# Altium schematic sheet 接线图-流量计.SchDoc
size A3; PageSetup: Record=PageOptions|CenterHorizontal=True|CenterVertical=True|PrintScale=1.04|XCorrection=1.00|YCorrection=1.00|PrintKind=0|BorderSize=5000000|LeftOffset=0|BottomOffset=0|Orientation=2|PaperLength=1000|PaperWidth=1000|Scale=100|PaperSource=7|PrintQuality=600|MediaType=1|DitherType=10|PaperKind=A3|PrintScaleMode=1
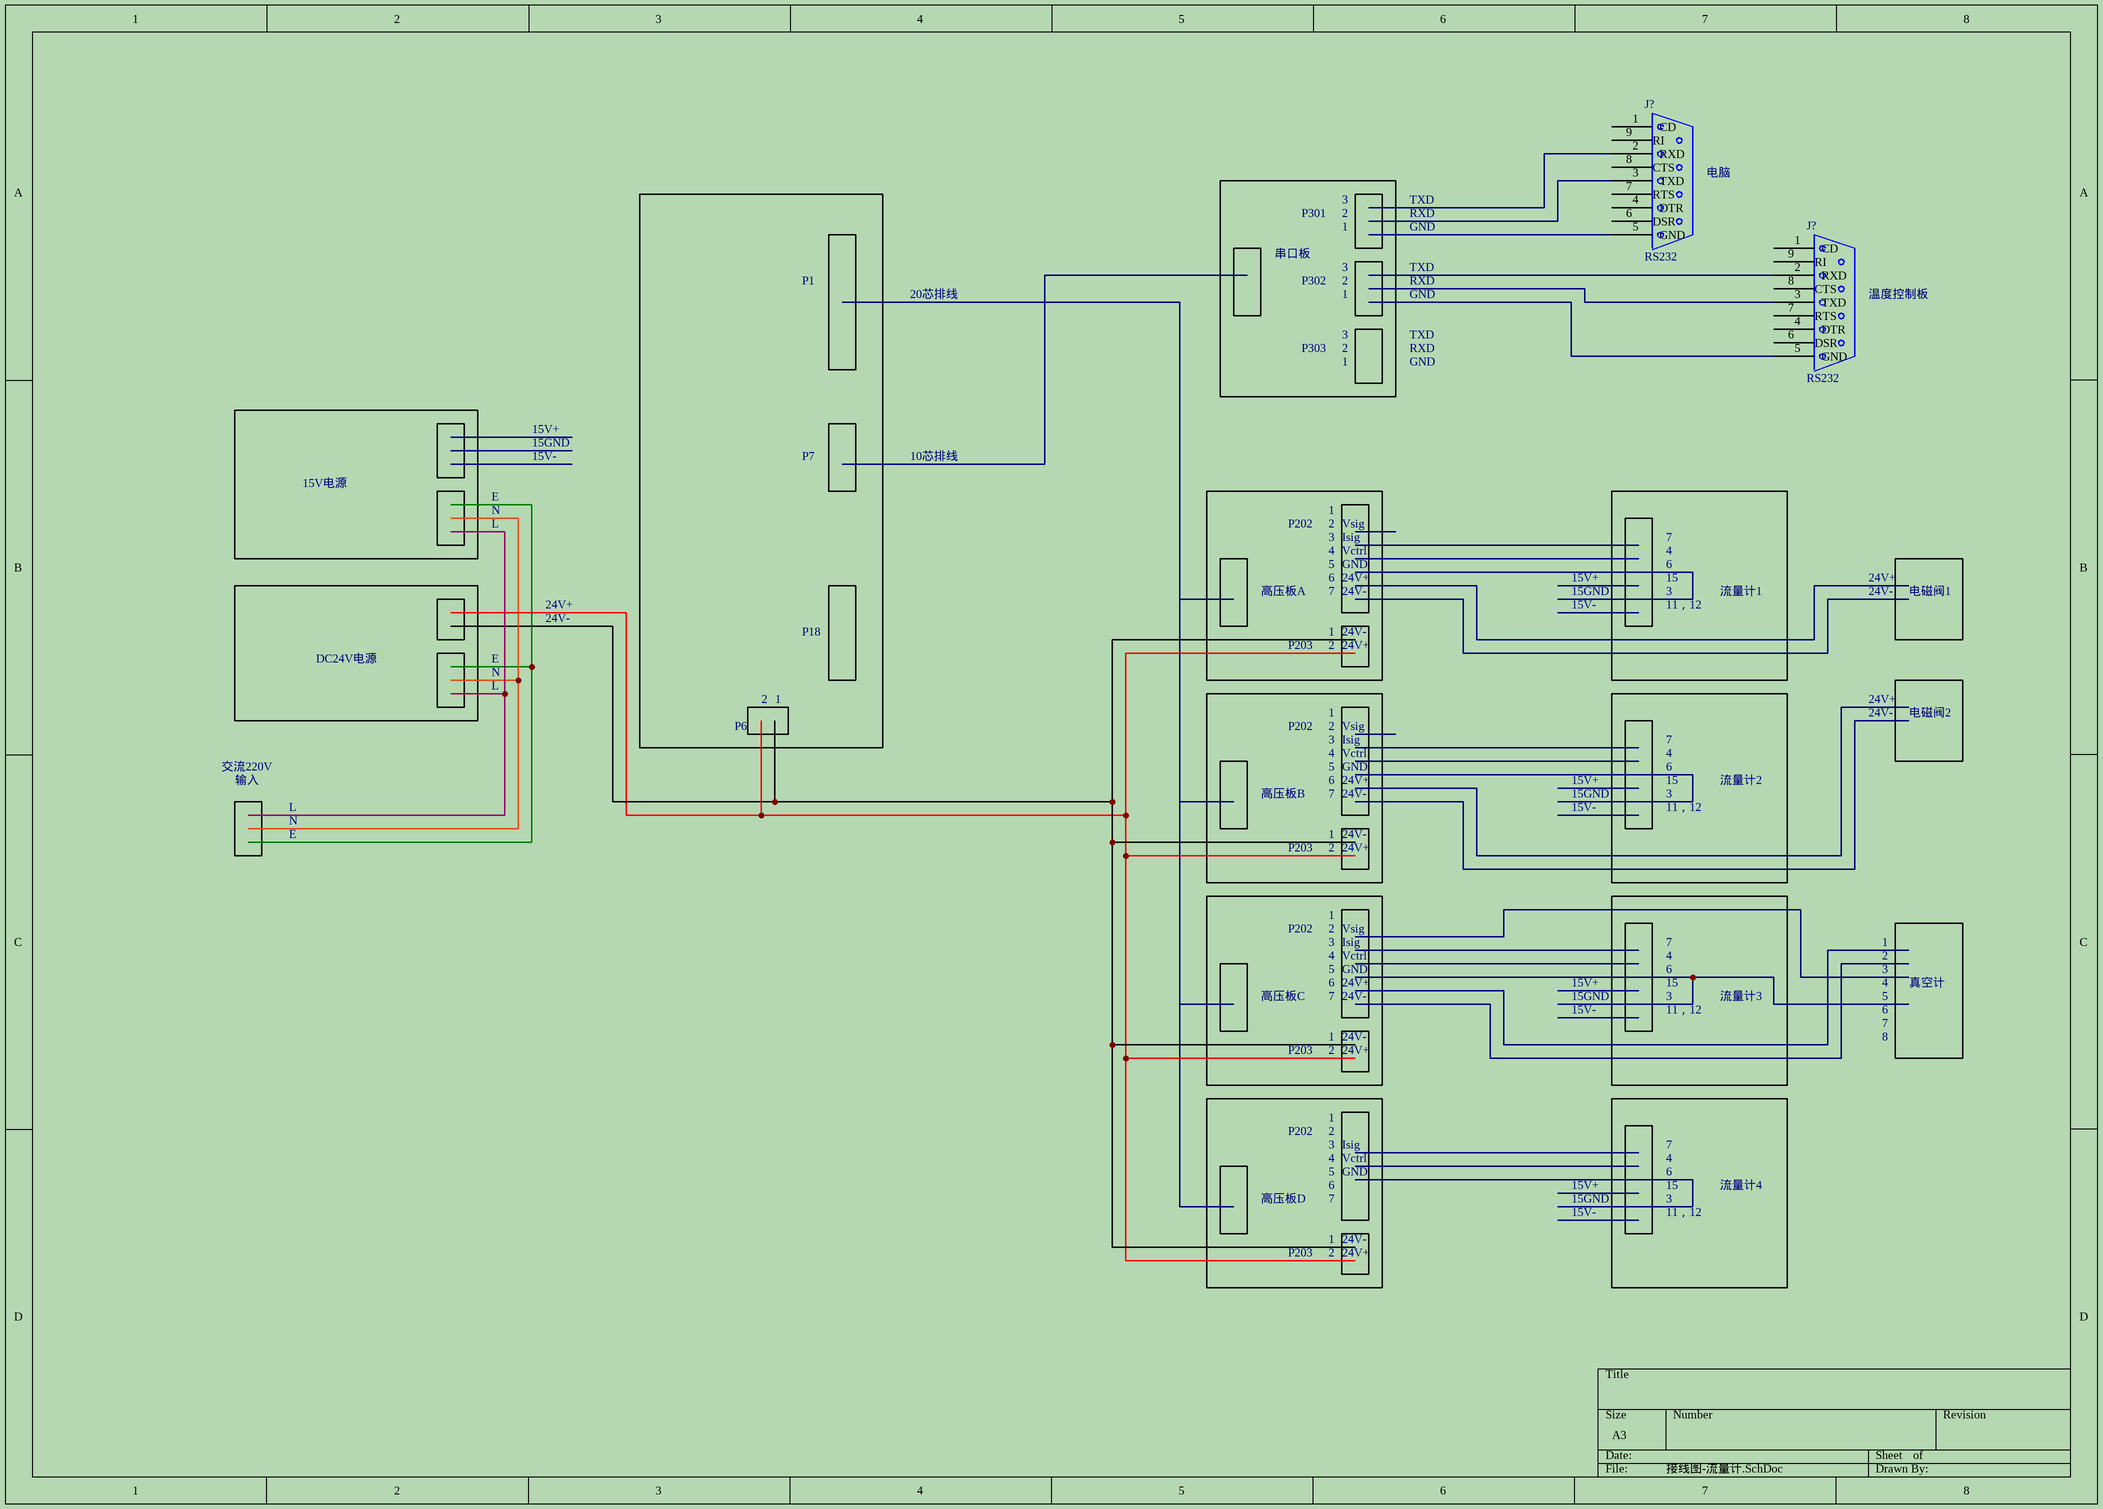
[diagram p0: 接线图-流量计.SchDoc]

## Parts
(Parts that share a designator on the sheet are numbered #1, #2 ... from top to bottom, then left to right.)
J?#1  RS232  [DB9P/M]
J?#2  RS232  [DB9P/M]

## Nets

Not connected (* = marked no-connect by the designer): J?#1 1(CD) 2(RXD) 3(TXD) 4(DTR) 5(GND) 6(DSR) 7(RTS) 8(CTS) 9(RI); J?#2 1(CD) 2(RXD) 3(TXD) 4(DTR) 5(GND) 6(DSR) 7(RTS) 8(CTS) 9(RI)

## Notes on the sheet
- 电脑
- P301
- 1
- 2
- 3
- TXD
- RXD
- GND
- P1
- 20芯排线
- 串口板
- P302
- 温度控制板
- P303
- 15V+
- 15GND
- 15V电源
- N
- E
- 15V-
- P7
- 10芯排线
- L
- P202
- 4
- 5
- 6
- Vsig
- Isig
- Vctrl
- 24V+
- 7
- 15
- 24V-
- P18
- 高压板A
- P203
- 11，12
- 流量计1
- 电磁阀1
- DC24V电源
- 电磁阀2
- 交流220V
- 输入
- P6
- 流量计2
- 高压板B
- 真空计
- 高压板C
- 流量计3
- 8
- 流量计4
- 高压板D

## Library data of the parts
J?#1 J?#2 = RS232: Direction is DTE (Computer) relative DCE (Modem). (At the Computer)